# Altium project ADH_XC7Z010_SoC.PrjPcb (part 4 of 10)
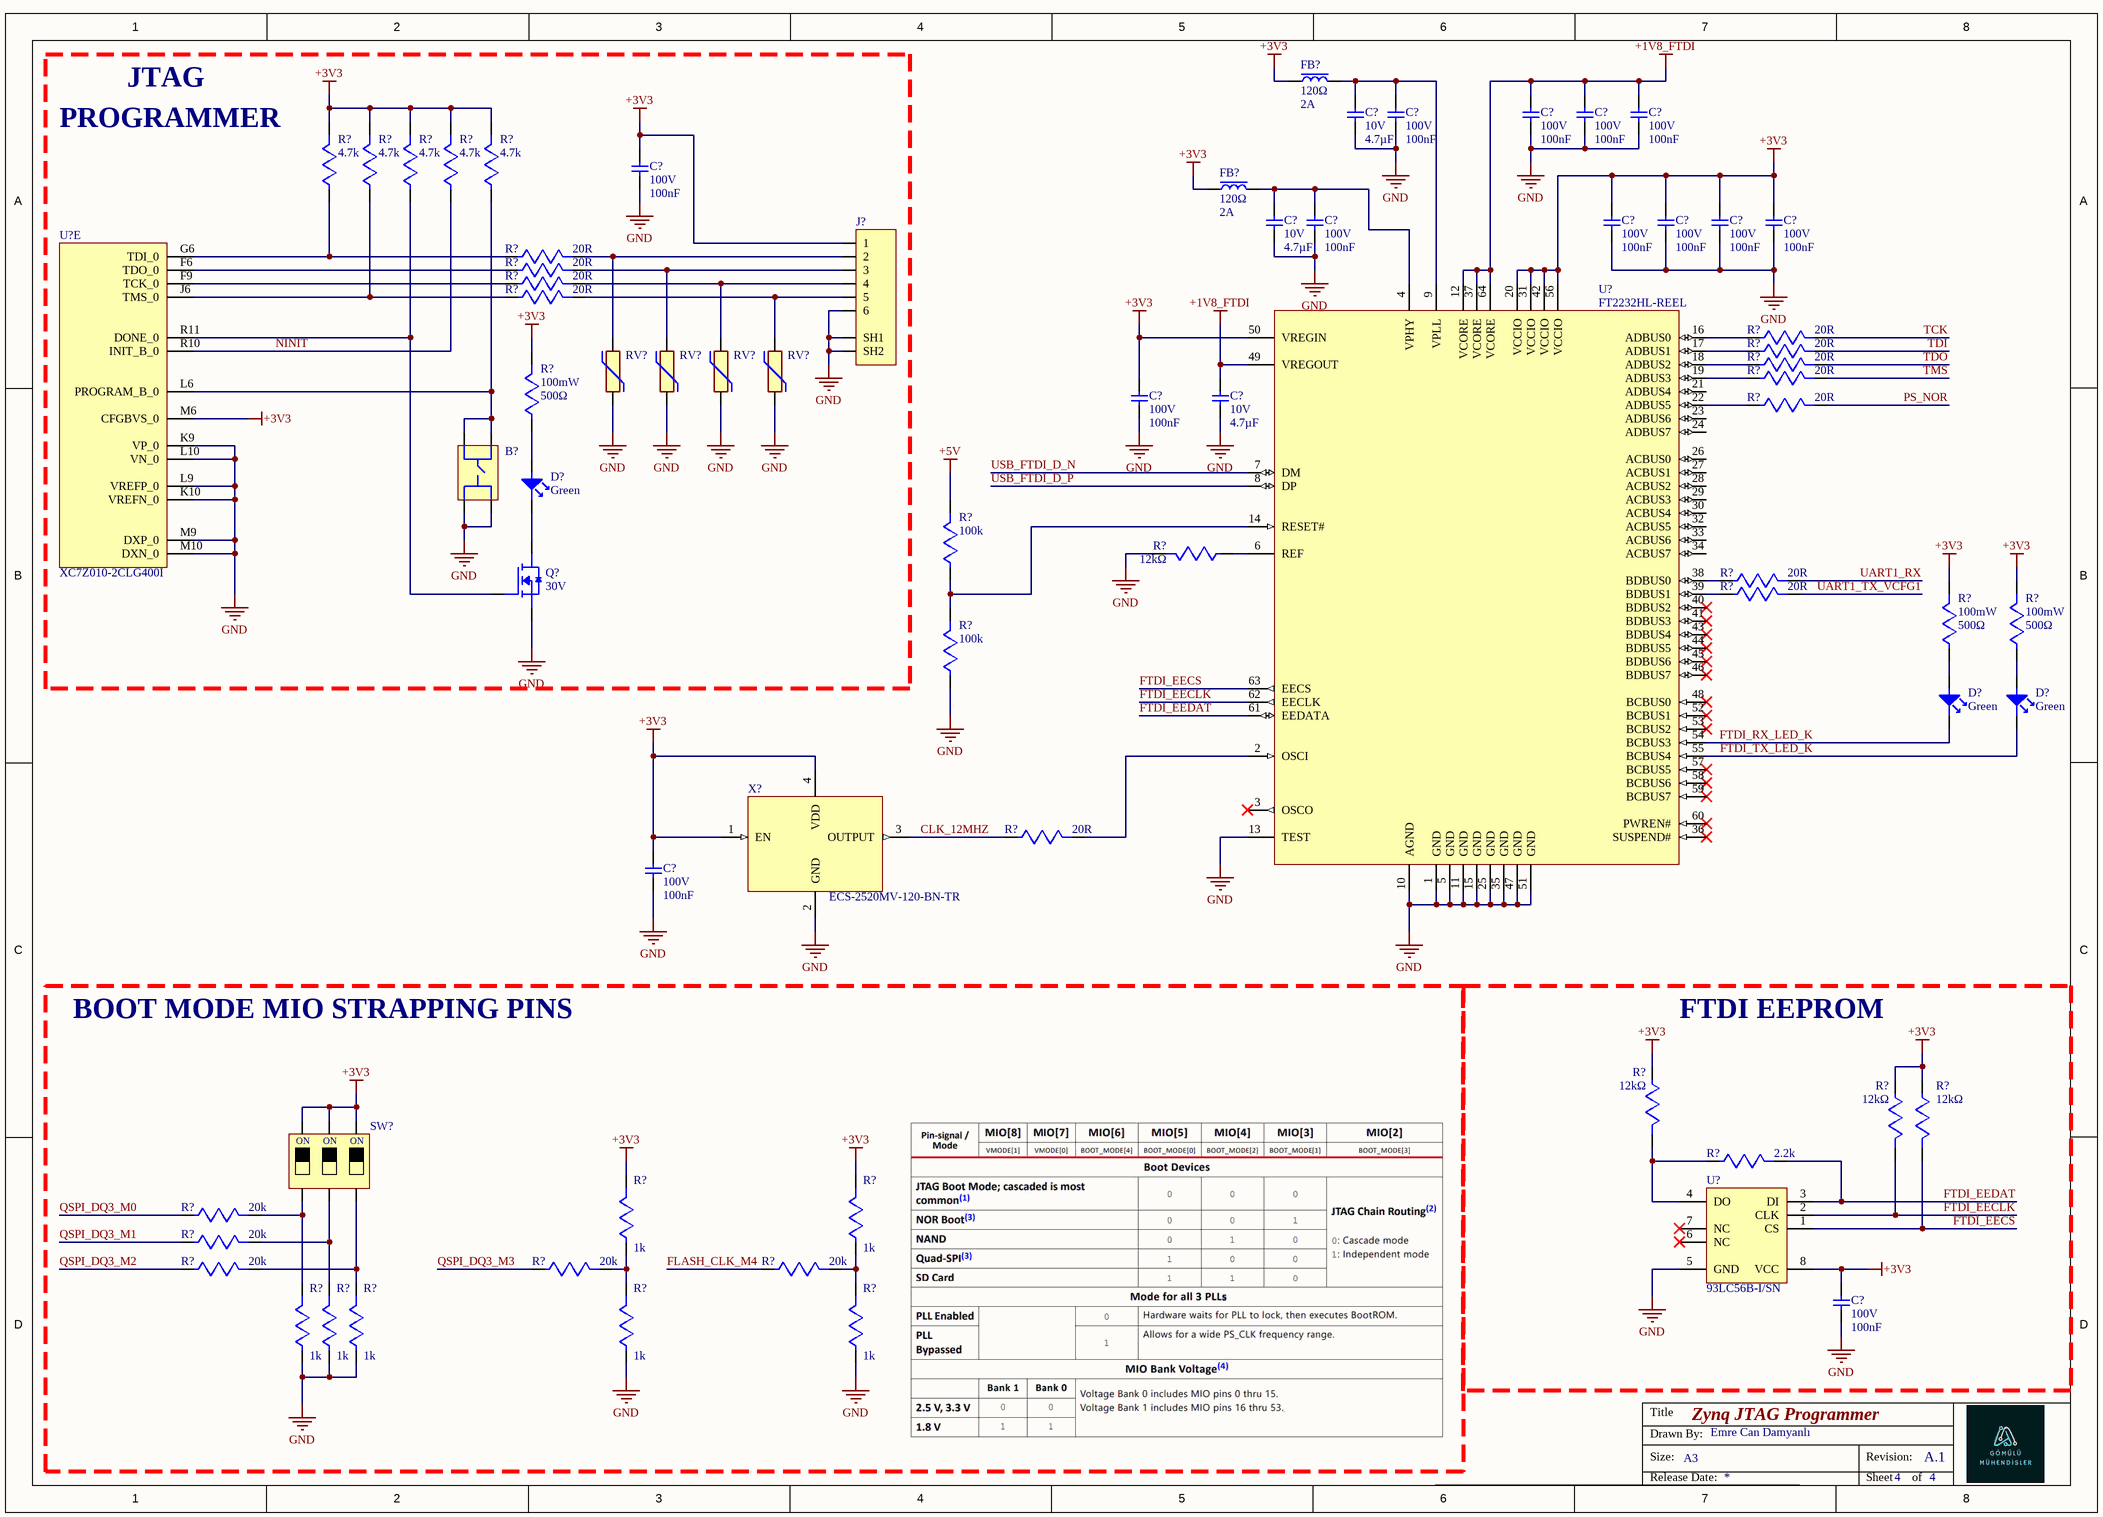
[diagram p9: Zynq_JTAG_Programmer.SchDoc]

## Sheet Zynq_JTAG_Programmer.SchDoc: Zynq JTAG Programmer (continued)

### Library data of the parts
B?#1 = GSPTS0020: Tactile Switch SPST-NO Top Actuated Surface Mount; Datasheet: https://www.ckswitches.com/media/2728/pts815.pdf
C?#100-C?#103 C?#105-C?#110 C?#112 C?#114 C?#115 = GCJ188R72A104KA01D: Cap Ceramic 0.1uF 100V X7R 10% Pad SMD 0603 Soft Termination 125C Automotive T/R; Manufacturer: Murata; Material: 4241ConductorMaterial; Supplier: Digikey; Supplier Part Number: 490-13420-1-ND; Manufacturer Part Number: GCJ188R72A104KA01D; RoHS: Yes; Category: Ceramic Capacitors; Stock: 681954; Pricing: 1=0,19, 10=0,123, 50=0,0774, 100=0,0619, 500=0,04472, 1000=0,03956 (USD); Mounting Technology: Surface Mount; Case/Package: 0603; Case Code (Metric): 1608; Case Code (Imperial): 0603; Min Operating Temperature: -55°C; Max Operating Temperature: 125°C; Packaging: Cut Tape; Tolerance: 10%; Features: Soft Termination; Series: GCJ; Length: 0.063inch; Width: 0.031inch; Height: 900um; Thickness: 0.035inch; Ratings: AEC-Q200; RoHS Compliant: Yes; Lead Free: 5697LeadFree; ComponentLink1URL: https://datasheet.octopart.com/GCJ188R72A104KA01D-Murata-datasheet-78375067.pdf?src-supplier=Future+Electronics; ComponentLink1Description: https://datasheet.octopart.com/GCJ188R72A104KA01D-Murata-datasheet-78375067.pdf?src-supplier=Future+Electronics; ComponentLink2URL: http://search.murata.co.jp/Ceramy/image/img/A01X/partnumbering_e_02.pdf?src-supplier=Digikey; ComponentLink2Description: http://search.murata.co.jp/Ceramy/image/img/A01X/partnumbering_e_02.pdf?src-supplier=Digikey; ComponentLink3URL: https://www.murata.com/~/media/webrenewal/support/library/catalog/products/capacitor/mlcc/c03e.ashx?la=en-us&src-supplier=Digikey; ComponentLink3Description: https://www.murata.com/~/media/webrenewal/support/library/catalog/products/capacitor/mlcc/c03e.ashx?la=en-us&src-supplier=Digikey; ComponentLink4URL: https://datasheet.octopart.com/GCJ188R72A104KA01D-Murata-datasheet-165611796.pdf?src-supplier=TME; ComponentLink4Description: https://datasheet.octopart.com/GCJ188R72A104KA01D-Murata-datasheet-165611796.pdf?src-supplier=TME
C?#104 C?#111 C?#113 = CL05A475MP5NRNC: Ceramic Capacitor, Multilayer, Ceramic, 10V, 20% +Tol, 20% -Tol, X5R, +-15% TC, 4.7uF, Surface Mount, 0402 inch; Manufacturer: Samsung Electro-Mechanics; Supplier: Avnet; Supplier Part Number: CL05A475MP5NRNC; Manufacturer Part Number: CL05A475MP5NRNC; RoHS: Compliant; Category: Ceramic Capacitors; Stock: 40000; Pricing: 10000=0,00671, 20000=0,00663, 40000=0,0066, 80000=0,00656, 160000=0,00653 (USD); Case/Package: 0402; Case Code (Imperial): 0402; Case Code (Metric): 1005; China RoHS: Compliant; Dielectric: X5R; Dielectric Material: Ceramic; Height: 500µm; Lead Free: Lead Free; Length: 1mm; Lifecycle Status: Production; Material: Ceramic; Max Operating Temperature: 85°C; Min Operating Temperature: -55°C; Mounting Technology: Surface Mount; Number of Terminals: 2; REACH SVHC: Yes; Schedule B: 8532240020, 8532240020|8532240020|8532240020|8532240020|8532240020|8532240020|8532240020|8532240020|8532240020|8532240020|8532240020|8532240020|8532240020|8532240020|8532240020|8532240020|8532240020|8532240020|8532240020|8532240020|8532240020|8532240020, 8532240020|8532240020|8532240020|8532240020|8532240020|8532240020|8532240020|8532240020|8532240020|8532240020|8532240020|8532240020|8532240020|8532240020|8532240020|8532240020|8532240020|8532240020|8532240020|8532240020|8532240020|8532240020|8532240020, 8532240020|8532240020|8532240020|8532240020|8532240020|8532240020|8532240020|8532240020|8532240020|8532240020|8532240020|8532240020|8532240020|8532240020|8532240020|8532240020|8532240020|8532240020|8532240020|8532240020|8532240020|8532240020|8532240020|85; Thickness: 558.8µm; Tolerance: 20%; Voltage Rating (DC): 10V; Width: 500µm; ComponentLink1URL: https://datasheet.octopart.com:443/CL05A475MP5NRNC-Samsung-Electro-Mechanics-datasheet-181551186.pdf?src-supplier=Newark; ComponentLink1Description: https://datasheet.octopart.com:443/CL05A475MP5NRNC-Samsung-Electro-Mechanics-datasheet-181551186.pdf?src-supplier=Newark; ComponentLink2URL: https://datasheet.octopart.com:443/CL05A475MP5NRNC-Samsung-Electro-Mechanics-datasheet-136482298.pdf?src-supplier=Newark; ComponentLink2Description: https://datasheet.octopart.com:443/CL05A475MP5NRNC-Samsung-Electro-Mechanics-datasheet-136482298.pdf?src-supplier=Newark; ComponentLink3URL: https://datasheet.octopart.com:443/CL05A475MP5NRNC-Samsung-Electro-Mechanics-datasheet-136031736.pdf?src-supplier=Future+Electronics; ComponentLink3Description: https://datasheet.octopart.com:443/CL05A475MP5NRNC-Samsung-Electro-Mechanics-datasheet-136031736.pdf?src-supplier=Future+Electronics; ComponentLink4URL: https://datasheet.octopart.com:443/CL05A475MP5NRNC-Samsung-Electro-Mechanics-datasheet-110226226.pdf?src-supplier=Future+Electronics; ComponentLink4Description: https://datasheet.octopart.com:443/CL05A475MP5NRNC-Samsung-Electro-Mechanics-datasheet-110226226.pdf?src-supplier=Future+Electronics; ComponentLink5URL: https://datasheet.octopart.com:443/CL05A475MP5NRNC-Samsung-Electro-Mechanics-datasheet-87580058.pdf?src-supplier=Future+Electronics; ComponentLink5Description: https://datasheet.octopart.com:443/CL05A475MP5NRNC-Samsung-Electro-Mechanics-datasheet-87580058.pdf?src-supplier=Future+Electronics; ComponentLink6URL: https://datasheet.octopart.com:443/CL05A475MP5NRNC-Samsung-Electro-Mechanics-datasheet-81461611.pdf?src-supplier=Future+Electronics; ComponentLink6Description: https://datasheet.octopart.com:443/CL05A475MP5NRNC-Samsung-Electro-Mechanics-datasheet-81461611.pdf?src-supplier=Future+Electronics; ComponentLink7URL: https://datasheet.octopart.com:443/CL05A475MP5NRNC-Samsung-datasheet-48647200.pdf?src-supplier=Future+Electronics; ComponentLink7Description: https://datasheet.octopart.com:443/CL05A475MP5NRNC-Samsung-datasheet-48647200.pdf?src-supplier=Future+Electronics; ComponentLink8URL: https://datasheet.octopart.com:443/CL05A475MP5NRNC-Samsung-datasheet-34153549.pdf?src-supplier=Future+Electronics; ComponentLink8Description: https://datasheet.octopart.com:443/CL05A475MP5NRNC-Samsung-datasheet-34153549.pdf?src-supplier=Future+Electronics; ComponentLink9URL: https://datasheet.octopart.com:443/CL05A475MP5NRNC-Samsung-datasheet-26589015.pdf?src-supplier=Future+Electronics; ComponentLink9Description: https://datasheet.octopart.com:443/CL05A475MP5NRNC-Samsung-datasheet-26589015.pdf?src-supplier=Future+Electronics; ComponentLink10URL: https://datasheet.octopart.com:443/CL05A475MP5NRNC-Samsung-datasheet-8324245.pdf?src-supplier=Future+Electronics; ComponentLink10Description: https://datasheet.octopart.com:443/CL05A475MP5NRNC-Samsung-datasheet-8324245.pdf?src-supplier=Future+Electronics; ComponentLink11URL: https://datasheet.octopart.com:443/CL05A475MP5NRNC-Samsung-Electro-Mechanics-datasheet-149136695.pdf?src-supplier=Future+Electronics; ComponentLink11Description: https://datasheet.octopart.com:443/CL05A475MP5NRNC-Samsung-Electro-Mechanics-datasheet-149136695.pdf?src-supplier=Future+Electronics; ComponentLink12URL: https://datasheet.octopart.com:443/CL05A475MP5NRNC-Samsung-datasheet-8326407.pdf?src-supplier=TME; ComponentLink12Description: https://datasheet.octopart.com:443/CL05A475MP5NRNC-Samsung-datasheet-8326407.pdf?src-supplier=TME
D?#4-D?#6 = LTST-C191KGKT: LTST-C191KGKT Lite-On LED, green, 18-71mcd, 130, 1.9V-2.4V SMD, 0603 1.6x0.8x0.55mm RoHS; Manufacturer: Vishay Lite-On; Lens Color: Colorless; Luminous Intensity: 35mcd; Viewing Angle: 130°; Lens Style: Flat,Rectangular,Colorless; Forward Voltage: 2V; Dominant Wavelength: 571nm; Test Current: 20mA; Lens Transparency: Clear; Wavelength: 574nm; Number of LEDs: 1; Max Power Dissipation: 75mW; Lens Size: 0.8mm; Supplier: Digi-Key; Supplier Part Number: 160-1446-1-ND; Manufacturer Part Number: LTST-C191KGKT; RoHS: Yes; Stock: 1655174; Pricing: 1=0,25, 10=0,136, 100=0,063, 500=0,05818, 1000=0,04557, 2000=0,0446 (USD); Mounting Technology: Surface Mount; Case/Package: 0603; Pins: 2; Case Code (Metric): 1608; Case Code (Imperial): 0603; Min Operating Temperature: -55°C; Max Operating Temperature: 85°C; Packaging: Tape and Reel; Series: -; Length: 1.6mm; Width: 0.8mm; Height: 0.65mm; RoHS Compliant: Yes; Lead Free: Lead Free; ComponentLink1URL: https://datasheet.ciiva.com/2109/ltst-c191kgkt-2109973.pdf?src-supplier=Digi-Key; ComponentLink1Description: https://datasheet.ciiva.com/2109/ltst-c191kgkt-2109973.pdf?src-supplier=Digi-Key
FB?#3 FB?#4 = BLM15PX121SN1D: Ferrite Beads Multi-Layer 120Ohm 25% 100MHz 2A 0.055Ohm DCR 0402 T/R; Manufacturer: Murata; Current Rating: 1.1A; DC Resistance (DCR): 55mΩ; Material: Steel; Number of Circuits: 1; Supplier: Arrow Electronics; Supplier Part Number: BLM15PX121SN1D; Manufacturer Part Number: BLM15PX121SN1D; RoHS: Compliant; Category: Ferrite Beads and Chips; Stock: 81241; Pricing: 4237=0,0236, 6000=0,023, 15000=0,023, 30000=0,022, 75000=0,022 (USD); Case/Package: 0402; Case Code (Imperial): 0402; Case Code (Metric): 1005; Contact Plating: Tin; Core Material: Ferrite; Height: 500µm; Lead Free: Lead Free; Length: 1mm; Lifecycle Status: Production; Max DC Current: 2A; Max Operating Temperature: 125°C; Min Operating Temperature: -55°C; Number of Lines: 1; Pins: 2; Number of Terminals: 2; Packaging: Tape and Reel; REACH SVHC: Yes; RMS Current (Irms): 2A; Schedule B: 8504500000, 8504500000|8504500000, 8504500000|8504500000|8504500000, 8504500000|8504500000|8504500000|8504500000; ESR: 55mΩ; Termination: SMD/SMT; Test Frequency: 100MHz; Tolerance: 25%; Weight: 652.039032µg; Width: 500µm; ComponentLink1URL: https://datasheet.octopart.com:443/BLM15PX121SN1D-Murata-datasheet-180806543.pdf?src-supplier=IHS; ComponentLink1Description: https://datasheet.octopart.com:443/BLM15PX121SN1D-Murata-datasheet-180806543.pdf?src-supplier=IHS; ComponentLink2URL: https://datasheet.octopart.com:443/BLM15PX121SN1D-Murata-datasheet-12522583.pdf?src-supplier=Upverter; ComponentLink2Description: https://datasheet.octopart.com:443/BLM15PX121SN1D-Murata-datasheet-12522583.pdf?src-supplier=Upverter; ComponentLink3URL: https://datasheet.octopart.com:443/BLM15PX121SN1D-Murata-datasheet-10083551.pdf?src-supplier=Upverter; ComponentLink3Description: https://datasheet.octopart.com:443/BLM15PX121SN1D-Murata-datasheet-10083551.pdf?src-supplier=Upverter; ComponentLink4URL: https://datasheet.octopart.com:443/BLM15PX121SN1D-Murata-datasheet-8508678.pdf?src-supplier=Upverter; ComponentLink4Description: https://datasheet.octopart.com:443/BLM15PX121SN1D-Murata-datasheet-8508678.pdf?src-supplier=Upverter; ComponentLink5URL: https://datasheet.octopart.com:443/BLM15PX121SN1D-Murata-datasheet-39128427.pdf?src-supplier=Newark; ComponentLink5Description: https://datasheet.octopart.com:443/BLM15PX121SN1D-Murata-datasheet-39128427.pdf?src-supplier=Newark; ComponentLink6URL: https://datasheet.octopart.com:443/BLM15PX121SN1D-Murata-datasheet-166171473.pdf?src-supplier=TME; ComponentLink6Description: https://datasheet.octopart.com:443/BLM15PX121SN1D-Murata-datasheet-166171473.pdf?src-supplier=TME; ComponentLink7URL: https://datasheet.octopart.com:443/BLM15PX121SN1D-Murata-datasheet-141257890.pdf?src-supplier=Ciiva; ComponentLink7Description: https://datasheet.octopart.com:443/BLM15PX121SN1D-Murata-datasheet-141257890.pdf?src-supplier=Ciiva; ComponentLink8URL: https://datasheet.octopart.com:443/BLM15PX121SN1D-Murata-datasheet-138706708.pdf?src-supplier=Ciiva; ComponentLink8Description: https://datasheet.octopart.com:443/BLM15PX121SN1D-Murata-datasheet-138706708.pdf?src-supplier=Ciiva; ComponentLink9URL: https://datasheet.octopart.com:443/BLM15PX121SN1D-Murata-datasheet-78375072.pdf?src-supplier=Future+Electronics; ComponentLink9Description: https://datasheet.octopart.com:443/BLM15PX121SN1D-Murata-datasheet-78375072.pdf?src-supplier=Future+Electronics; ComponentLink10URL: https://datasheet.octopart.com:443/BLM15PX121SN1D-Murata-datasheet-13563506.pdf?src-supplier=Future+Electronics; ComponentLink10Description: https://datasheet.octopart.com:443/BLM15PX121SN1D-Murata-datasheet-13563506.pdf?src-supplier=Future+Electronics; ComponentLink11URL: https://datasheet.octopart.com:443/BLM15PX121SN1D-Murata-datasheet-12545319.pdf?src-supplier=Future+Electronics; ComponentLink11Description: https://datasheet.octopart.com:443/BLM15PX121SN1D-Murata-datasheet-12545319.pdf?src-supplier=Future+Electronics; ComponentLink12URL: https://datasheet.octopart.com/BLM15PX121SN1D-Murata-datasheet-37129980.pdf; ComponentLink12Description: https://datasheet.octopart.com/BLM15PX121SN1D-Murata-datasheet-37129980.pdf; ComponentLink13URL: http://sigma.octopart.com:80/reach_statement/Murata-company-16.pdf?src-supplier=Compliance+Statements; ComponentLink13Description: http://sigma.octopart.com:80/reach_statement/Murata-company-16.pdf?src-supplier=Compliance+Statements
J?#2 = S6B-ZR-SM4A-TF: Header S6B-ZR-SM4A-TF, 1.50mm, 6-contacts, side entry, SMT, /1000/reel; Manufacturer: JST; Number of Contacts: 6; Gender: Male; Supplier: Digi-Key; Supplier Part Number: 455-S6B-ZR-SM4A-TFCT-ND; Manufacturer Part Number: S6B-ZR-SM4A-TF; RoHS: Yes; Category: Connectors; Stock: 59171; Pricing: 1=0,8, 10=0,701, 100=0,578, 500=0,50258 (USD); Mounting Technology: Surface Mount; Contact Plating: Tin; Contact Material: Brass; Number of Rows: 1; Termination: SMD/SMT; Packaging: Cut Tape; Series: ZH; Orientation: Horizontal; Reach SVHC Compliant: Yes; ComponentLink1URL: http://www.farnell.com/datasheets/1393424.pdf?src-supplier=Farnell; ComponentLink1Description: http://www.farnell.com/datasheets/1393424.pdf?src-supplier=Farnell; ComponentLink2URL: http://www.farnell.com/datasheets/621906.pdf?src-supplier=Newark; ComponentLink2Description: http://www.farnell.com/datasheets/621906.pdf?src-supplier=Newark; ComponentLink3URL: http://www.farnell.com/datasheets/621906.pdf?src-supplier=Element14; ComponentLink3Description: http://www.farnell.com/datasheets/621906.pdf?src-supplier=Element14
Q?#5 = DMG3402L-7: MOSFET N-CH 30V 4A SOT23; Manufacturer: Diodes; Rds On Max: 52mR; Input Capacitance: 464pF; Rise Time: 1.6ns; Max Power Dissipation: 1.4W; Fall Time: 2ns; Turn-Off Delay Time: 10.3ns; Turn-On Delay Time: 1.9ns; Gate to Source Voltage (Vgs): 12V; Number of Channels: 1; Polarity: N-CHANNEL; Supplier: Digi-Key; Supplier Part Number: DMG3402L-7DICT-ND; Manufacturer Part Number: DMG3402L-7; RoHS: Yes; Category: MOSFETs; Stock: 1011067; Pricing: 1=0,42, 10=0,298, 100=0,1503, 500=0,13316, 1000=0,10363 (USD); Mounting Technology: Surface Mount; Case/Package: SOT-23; Pins: 3; Weight: 0.000282oz; Min Operating Temperature: -55°C; Max Operating Temperature: 150°C; Package Quantity: 3000; Packaging: Tape and Reel; Continuous Drain Current (ID): 4A; Drain to Source Resistance: 52mR; Series: -; RoHS Compliant: Yes; Lead Free: Lead Free; ComponentLink1URL: http://www.mouser.com/ds/2/115/DMG3402L-473526.pdf?src-supplier=Mouser; ComponentLink1Description: http://www.mouser.com/ds/2/115/DMG3402L-473526.pdf?src-supplier=Mouser; ComponentLink2URL: http://diodes.com/datasheets/DMG3402L.pdf?src-supplier=Avnet; ComponentLink2Description: http://diodes.com/datasheets/DMG3402L.pdf?src-supplier=Avnet
R?#35-R?#39 = RC0603FR-074K7L: SMD Chip Resistor, 4.7 kOhm, ± 1%, 100 mW, 0603 [1608 Metric], Thick Film, General Purpose; Manufacturer: Yageo; Power Rating: 100mW; Voltage Rating (DC): 50V; Temperature Coefficient: 100ppm/°C; Supplier: Digi-Key; Supplier Part Number: 311-4.70KHRCT-ND; Manufacturer Part Number: RC0603FR-074K7L; RoHS: Yes; Category: Chip SMD Resistors; Stock: 7233601; Pricing: 1=0,1, 10=0,018, 50=0,0106, 100=0,0088, 500=0,00592, 1000=0,00505 (USD); Case/Package: 0603; Pins: 2; Case Code (Imperial): 0603; Case Code (Metric): 1608; Min Operating Temperature: -55°C; Max Operating Temperature: 155°C; Tolerance: 1%; Resistor Type: Thick Film; Packaging: Tape and Reel; Voltage Rating: 50V; Termination: SMD/SMT; Features: Moisture Resistant; Series: RC; Max Power Dissipation: 100mW; Number of Terminations: 2; Construction: Rectangular; Resistance Tolerance: 1%; Length: 1.6mm; Width: 0.8mm; Depth: 0.8mm; Lead Pitch: 0.3mm; Lead Free: Lead Free; Reach SVHC Compliant: Unknown; RoHS Compliant: Yes; Military Standard: Not; ComponentLink1URL: https://datasheet.ciiva.com/15189/getdatasheetpartid-422754-15189760.pdf?src-supplier=Verical; ComponentLink1Description: https://datasheet.ciiva.com/15189/getdatasheetpartid-422754-15189760.pdf?src-supplier=Verical; ComponentLink2URL: https://datasheet.ciiva.com/7660/38590-7660794.pdf?src-supplier=Element14; ComponentLink2Description: https://datasheet.ciiva.com/7660/38590-7660794.pdf?src-supplier=Element14; ComponentLink3URL: https://datasheet.ciiva.com/22747/443971-22747528.pdf?src-supplier=Element14; ComponentLink3Description: https://datasheet.ciiva.com/22747/443971-22747528.pdf?src-supplier=Element14; ComponentLink4URL: https://datasheet.ciiva.com/46440/1868787-46440909.pdf?src-supplier=Element14; ComponentLink4Description: https://datasheet.ciiva.com/46440/1868787-46440909.pdf?src-supplier=Element14; ComponentLink5URL: https://datasheet.ciiva.com/7746/1868787-7746365.pdf?src-supplier=Element14; ComponentLink5Description: https://datasheet.ciiva.com/7746/1868787-7746365.pdf?src-supplier=Element14; ComponentLink6URL: https://datasheet.ciiva.com/7746/1738695-7746366.pdf?src-supplier=Element14; ComponentLink6Description: https://datasheet.ciiva.com/7746/1738695-7746366.pdf?src-supplier=Element14
R?#40-R?#47 R?#49 R?#52 R?#53 R?#57 = RC0603FR-0720RL: SMD Chip Resistor, 20 Ohm, ± 1%, 100 mW, 0603 [1608 Metric], Thick Film, General Purpose; Manufacturer: Yageo; Power Rating: 100mW; Voltage Rating: 50V; Temperature Coefficient: 100ppm/°C; Working Voltage: 75V; Supplier: Digi-Key; Supplier Part Number: 311-20.0HRCT-ND; Manufacturer Part Number: RC0603FR-0720RL; RoHS: Yes; Category: Chip SMD Resistors; Stock: 293682; Pricing: 1=0,1, 10=0,018, 50=0,0106, 100=0,0088, 500=0,00592, 1000=0,00505 (USD); Case/Package: 0603; Case Code (Imperial): 0603; Case Code (Metric): 1608; Min Operating Temperature: -55°C; Max Operating Temperature: 155°C; Tolerance: 1%; Packaging: Tape and Reel; Package Quantity: 5000; Termination: SMD/SMT; Resistor Type: Thick Film; Number of Terminations: 2; Max Power Dissipation: 100mW; Voltage Rating (DC): 50V; Features: Moisture Resistant; Series: RC; Construction: Rectangular; Technology: THICK FILM; Resistance Tolerance: 1%; Length: 1.6mm; Width: 0.031inch; Height: 0.45mm; Depth: 0.8mm; Reach SVHC Compliant: No; Military Standard: Not; Lead Free: Lead Free; RoHS Compliant: Yes; ComponentLink1URL: https://datasheet.ciiva.com/11819/0900766b80f96399-11819290.pdf?src-supplier=Rs; ComponentLink1Description: https://datasheet.ciiva.com/11819/0900766b80f96399-11819290.pdf?src-supplier=Rs; ComponentLink2URL: https://datasheet.ciiva.com/46395/443971-46395031.pdf?src-supplier=Element14; ComponentLink2Description: https://datasheet.ciiva.com/46395/443971-46395031.pdf?src-supplier=Element14; ComponentLink3URL: https://datasheet.ciiva.com/2454/pyu-r-int-thick-7-2454028.pdf?src-supplier=Digi-Key; ComponentLink3Description: https://datasheet.ciiva.com/2454/pyu-r-int-thick-7-2454028.pdf?src-supplier=Digi-Key; ComponentLink4URL: https://datasheet.ciiva.com/2454/pyu-r-int-thick-7-2454029.pdf?src-supplier=Digi-Key; ComponentLink4Description: https://datasheet.ciiva.com/2454/pyu-r-int-thick-7-2454029.pdf?src-supplier=Digi-Key; ComponentLink5URL: https://datasheet.ciiva.com/2454/pyu-r-int-thick-7-2454027.pdf?src-supplier=Digi-Key; ComponentLink5Description: https://datasheet.ciiva.com/2454/pyu-r-int-thick-7-2454027.pdf?src-supplier=Digi-Key; ComponentLink6URL: https://datasheet.ciiva.com/12557/rc0603-272842-12557941.pdf?src-supplier=Mouser; ComponentLink6Description: https://datasheet.ciiva.com/12557/rc0603-272842-12557941.pdf?src-supplier=Mouser; ComponentLink7URL: https://datasheet.ciiva.com/15189/getdatasheetpartid-324013-15189653.pdf?src-supplier=Verical; ComponentLink7Description: https://datasheet.ciiva.com/15189/getdatasheetpartid-324013-15189653.pdf?src-supplier=Verical
R?#48 R?#54 R?#55 = RT0603BRC07500RL: Fixed Resistor, Thin Film, 0.1W, 500ohm, 75V, 0.1% +/-Tol, 15ppm/Cel, Surface Mount, 0603; Manufacturer: Yageo Group; Temperature Coefficient: 15ppm/°C; Supplier: Farnell; Supplier Part Number: 4152629; Manufacturer Part Number: RT0603BRC07500RL; RoHS: Compliant; Category: Chip SMD Resistors; Stock: 4870; Pricing: 5000=0,12 (EUR); Case/Package: 0603; China RoHS: Non-Compliant; Composition: Thin Film; Height: 450µm; Lifecycle Status: Production; Max Operating Temperature: 155°C; Min Operating Temperature: -55°C; Mounting Technology: Surface Mount; Number of Terminals: 2; Packaging: Tape & Reel; Power Dissipation: 100mW; REACH SVHC: Yes; Tolerance: 0.1%; Voltage Rating: 75V; Width: 800µm; Working Voltage: 75V; ComponentLink1URL: https://datasheet.octopart.com:443/RT0603BRC07500RL-Yageo-datasheet-176402239.pdf?src-supplier=IHS; ComponentLink1Description: https://datasheet.octopart.com:443/RT0603BRC07500RL-Yageo-datasheet-176402239.pdf?src-supplier=IHS; ComponentLink2URL: https://datasheet.octopart.com:443/RT0603BRC07500RL-Yageo-datasheet-141265893.pdf?src-supplier=ODG+(Origin+Data+Global); ComponentLink2Description: https://datasheet.octopart.com:443/RT0603BRC07500RL-Yageo-datasheet-141265893.pdf?src-supplier=ODG+(Origin+Data+Global); ComponentLink3URL: https://datasheet.octopart.com:443/RT0603BRC07500RL-Yageo-datasheet-169971040.pdf?src-supplier=Upverter; ComponentLink3Description: https://datasheet.octopart.com:443/RT0603BRC07500RL-Yageo-datasheet-169971040.pdf?src-supplier=Upverter; ComponentLink4URL: https://datasheet.octopart.com:443/RT0603BRC07500RL-Yageo-datasheet-166250672.pdf?src-supplier=Future+Electronics; ComponentLink4Description: https://datasheet.octopart.com:443/RT0603BRC07500RL-Yageo-datasheet-166250672.pdf?src-supplier=Future+Electronics; ComponentLink5URL: https://datasheet.octopart.com/RT0603BRC07500RL-Yageo-datasheet-86813807.pdf; ComponentLink5Description: https://datasheet.octopart.com/RT0603BRC07500RL-Yageo-datasheet-86813807.pdf; ComponentLink6URL: http://sigma.octopart.com:80/rohs_statement/Yageo-company-2.pdf?src-supplier=Compliance+Statements; ComponentLink6Description: http://sigma.octopart.com:80/rohs_statement/Yageo-company-2.pdf?src-supplier=Compliance+Statements; ComponentLink7URL: http://sigma.octopart.com:80/conflict_mineral_statement/Yageo-company-3.pdf?src-supplier=Compliance+Statements; ComponentLink7Description: http://sigma.octopart.com:80/conflict_mineral_statement/Yageo-company-3.pdf?src-supplier=Compliance+Statements
R?#50 R?#56 = RC0603FR-07100KL: SMD Chip Resistor, 100 kOhm, ± 1%, 100 mW, 0603 [1608 Metric], Thick Film, General Purpose; Manufacturer: Yageo; Temperature Coefficient: 100ppm/°C; Voltage Rating (DC): 50V; Power Rating: 100mW; Supplier: Digi-Key; Supplier Part Number: 311-100KHRCT-ND; Manufacturer Part Number: RC0603FR-07100KL; RoHS: Yes; Category: Chip SMD Resistors; Stock: 3229176; Pricing: 1=0,1, 10=0,018, 50=0,0106, 100=0,0088, 500=0,00592, 1000=0,00505 (USD); Case/Package: 0603; Pins: 2; Case Code (Imperial): 0603; Case Code (Metric): 1608; Min Operating Temperature: -55°C; Max Operating Temperature: 155°C; Tolerance: 1%; Resistor Type: Thick Film; Packaging: Tape and Reel; Voltage Rating: 50V; Termination: SMD/SMT; Number of Terminations: 2; Features: Moisture Resistant; Series: RC; Max Power Dissipation: 100mW; Resistance Tolerance: 1%; Construction: Rectangular; Technology: THICK FILM; Length: 1.6mm; Width: 0.8mm; Height: 0.45mm; Depth: 0.8mm; Reach SVHC Compliant: No; Military Standard: Not; RoHS Compliant: Yes
R?#51 R?#58-R?#60 = RC0603FR-0712KL: 100mW Thick Film Resistors 75V ±100ppm/℃ ±1% 12kΩ 0603 Chip Resistor - Surface Mount ROHS; Manufacturer: Yageo Group; Temperature Coefficient: 100ppm/°C; Voltage Rating: 50V; Supplier: Farnell; Supplier Part Number: 9238611; Manufacturer Part Number: RC0603FR-0712KL; RoHS: Compliant; Category: Chip SMD Resistors; Stock: 298850; Pricing: 10=0,0061, 100=0,0052, 500=0,0048, 1000=0,0043, 2500=0,0036 (EUR); Case/Package: 0603; Case Code (Imperial): 0603; Case Code (Metric): 1608; China RoHS: Non-Compliant; Composition: Thick Film; Depth: 800µm; Features: Moisture Resistant; Height: 450µm; Lead Free: Lead Free; Length: 1.6mm; Lifecycle Status: Production; Max Operating Temperature: 155°C; Max Power Dissipation: 100mW; Military Standard: Not; Min Operating Temperature: -55°C; Mounting Technology: Surface Mount; Pins: 2; Number of Terminals: 2; Number of Terminations: 2; Packaging: Tape and Reel; Power Dissipation: 100mW; Power Rating: 100mW; REACH SVHC: Yes; Schedule B: 8533210045, 8533210045|8533210045|8533210045|8533210045|8533210045; Termination: SMD/SMT; Tolerance: 1%; Voltage Rating (DC): 50V; Width: 800µm; Working Voltage: 75V; ComponentLink1URL: https://datasheet.octopart.com:443/RC0603FR-0712KL-Yageo-datasheet-175887523.pdf?src-supplier=IHS; ComponentLink1Description: https://datasheet.octopart.com:443/RC0603FR-0712KL-Yageo-datasheet-175887523.pdf?src-supplier=IHS; ComponentLink2URL: https://datasheet.octopart.com:443/RC0603FR-0712KL-Yageo-datasheet-8328172.pdf?src-supplier=Newark; ComponentLink2Description: https://datasheet.octopart.com:443/RC0603FR-0712KL-Yageo-datasheet-8328172.pdf?src-supplier=Newark; ComponentLink3URL: https://datasheet.octopart.com:443/RC0603FR-0712KL-Yageo-datasheet-175423674.pdf?src-supplier=Newark; ComponentLink3Description: https://datasheet.octopart.com:443/RC0603FR-0712KL-Yageo-datasheet-175423674.pdf?src-supplier=Newark; ComponentLink4URL: https://datasheet.octopart.com:443/RC0603FR-0712KL-Yageo-datasheet-34211833.pdf?src-supplier=Newark; ComponentLink4Description: https://datasheet.octopart.com:443/RC0603FR-0712KL-Yageo-datasheet-34211833.pdf?src-supplier=Newark; ComponentLink5URL: https://datasheet.octopart.com:443/RC0603FR-0712KL-Yageo-datasheet-62067350.pdf?src-supplier=element14+APAC; ComponentLink5Description: https://datasheet.octopart.com:443/RC0603FR-0712KL-Yageo-datasheet-62067350.pdf?src-supplier=element14+APAC; ComponentLink6URL: https://datasheet.octopart.com:443/RC0603FR-0712KL-Yageo-datasheet-103092701.pdf?src-supplier=Upverter; ComponentLink6Description: https://datasheet.octopart.com:443/RC0603FR-0712KL-Yageo-datasheet-103092701.pdf?src-supplier=Upverter; ComponentLink7URL: https://datasheet.octopart.com:443/RC0603FR-0712KL-Yageo-datasheet-141435368.pdf?src-supplier=Upverter; ComponentLink7Description: https://datasheet.octopart.com:443/RC0603FR-0712KL-Yageo-datasheet-141435368.pdf?src-supplier=Upverter; ComponentLink8URL: https://datasheet.octopart.com:443/RC0603FR-0712KL-Yageo-Group-datasheet-190305687.pdf?src-supplier=Future+Electronics; ComponentLink8Description: https://datasheet.octopart.com:443/RC0603FR-0712KL-Yageo-Group-datasheet-190305687.pdf?src-supplier=Future+Electronics; ComponentLink9URL: https://datasheet.octopart.com:443/RC0603FR-0712KL-Yageo-datasheet-164759695.pdf?src-supplier=Future+Electronics; ComponentLink9Description: https://datasheet.octopart.com:443/RC0603FR-0712KL-Yageo-datasheet-164759695.pdf?src-supplier=Future+Electronics; ComponentLink10URL: https://datasheet.octopart.com:443/RC0603FR-0712KL-Yageo-datasheet-137700087.pdf?src-supplier=Future+Electronics; ComponentLink10Description: https://datasheet.octopart.com:443/RC0603FR-0712KL-Yageo-datasheet-137700087.pdf?src-supplier=Future+Electronics; ComponentLink11URL: https://datasheet.octopart.com:443/RC0603FR0712KL-Yageo-datasheet-27584510.pdf?src-supplier=Future+Electronics; ComponentLink11Description: https://datasheet.octopart.com:443/RC0603FR0712KL-Yageo-datasheet-27584510.pdf?src-supplier=Future+Electronics; ComponentLink12URL: https://datasheet.octopart.com:443/RC0603FR-0712KL-Yageo-datasheet-15599030.pdf?src-supplier=Future+Electronics; ComponentLink12Description: https://datasheet.octopart.com:443/RC0603FR-0712KL-Yageo-datasheet-15599030.pdf?src-supplier=Future+Electronics; ComponentLink13URL: https://datasheet.octopart.com:443/RC0603FR-0712KL-Yageo-datasheet-12596169.pdf?src-supplier=Future+Electronics; ComponentLink13Description: https://datasheet.octopart.com:443/RC0603FR-0712KL-Yageo-datasheet-12596169.pdf?src-supplier=Future+Electronics; ComponentLink14URL: https://datasheet.octopart.com:443/RC0603FR-0712KL-Yageo-datasheet-8324193.pdf?src-supplier=Future+Electronics; ComponentLink14Description: https://datasheet.octopart.com:443/RC0603FR-0712KL-Yageo-datasheet-8324193.pdf?src-supplier=Future+Electronics; ComponentLink15URL: https://datasheet.octopart.com:443/RC0603FR-0712KL-Yageo-Group-datasheet-176638170.pdf?src-supplier=Farnell; ComponentLink15Description: https://datasheet.octopart.com:443/RC0603FR-0712KL-Yageo-Group-datasheet-176638170.pdf?src-supplier=Farnell; ComponentLink16URL: https://datasheet.octopart.com/RC0603FR-0712KL-Yageo-datasheet-73766026.pdf; ComponentLink16Description: https://datasheet.octopart.com/RC0603FR-0712KL-Yageo-datasheet-73766026.pdf; ComponentLink17URL: https://datasheet.octopart.com:443/RC0603FR-0712KL-Yageo-datasheet-30459151.pdf?src-supplier=Seeed+Studio; ComponentLink17Description: https://datasheet.octopart.com:443/RC0603FR-0712KL-Yageo-datasheet-30459151.pdf?src-supplier=Seeed+Studio; ComponentLink18URL: https://datasheet.octopart.com:443/RC0603FR-0712KL-Yageo-datasheet-118562.pdf?src-supplier=DigiKey; ComponentLink18Description: https://datasheet.octopart.com:443/RC0603FR-0712KL-Yageo-datasheet-118562.pdf?src-supplier=DigiKey; ComponentLink19URL: http://sigma.octopart.com:80/conflict_mineral_statement/Yageo-company-3.pdf?src-supplier=Compliance+Statements; ComponentLink19Description: http://sigma.octopart.com:80/conflict_mineral_statement/Yageo-company-3.pdf?src-supplier=Compliance+Statements; ComponentLink20URL: http://sigma.octopart.com:80/rohs_statement/Yageo-company-2.pdf?src-supplier=Compliance+Statements; ComponentLink20Description: http://sigma.octopart.com:80/rohs_statement/Yageo-company-2.pdf?src-supplier=Compliance+Statements
R?#61 = RC0603FR-072K2L: SMD Chip Resistor, 2.2 kOhm, ± 1%, 100 mW, 0603 [1608 Metric], Thick Film, General Purpose; Manufacturer: Yageo; Temperature Coefficient: 100ppm/°C; Power Rating: 100mW; Voltage Rating: 50V; Supplier: Digi-Key; Supplier Part Number: 311-2.20KHRCT-ND; Manufacturer Part Number: RC0603FR-072K2L; RoHS: Yes; Category: Chip SMD Resistors; Stock: 709886; Pricing: 1=0,1, 10=0,019, 50=0,0112, 100=0,0093, 500=0,00622, 1000=0,00532 (USD); Case/Package: 0603; Case Code (Imperial): 0603; Case Code (Metric): 1608; Min Operating Temperature: -55°C; Max Operating Temperature: 155°C; Tolerance: 1%; Packaging: Tape and Reel; Resistor Type: Thick Film; Number of Terminations: 2; Max Power Dissipation: 100mW; Features: Moisture Resistant; Series: RC; Resistance Tolerance: 1%; Lead Free: Lead Free; Reach SVHC Compliant: Unknown; RoHS Compliant: Yes
R?#62 R?#65-R?#68 = RC0603FR-0720KL: SMD Chip Resistor, 20 kOhm, ± 1%, 100 mW, 0603 [1608 Metric], Thick Film, General Purpose; Manufacturer: Yageo; Temperature Coefficient: 100ppm/°C; Voltage Rating (DC): 50V; Power Rating: 100mW; Supplier: Digi-Key; Supplier Part Number: 311-20.0KHRCT-ND; Manufacturer Part Number: RC0603FR-0720KL; RoHS: Yes; Category: Chip SMD Resistors; Stock: 6106196; Pricing: 1=0,1, 10=0,018, 50=0,0106, 100=0,0088, 500=0,00592, 1000=0,00505 (USD); Case/Package: 0603; Pins: 2NUMBER; Case Code (Imperial): 0603; Case Code (Metric): 1608; Min Operating Temperature: -55°C; Max Operating Temperature: 155°C; Tolerance: 1%; Packaging: Tape and Reel; Resistor Type: Thick Film; Voltage Rating: 50V; Package Quantity: 1; Termination: SMD/SMT; Number of Terminations: 2; Max Power Dissipation: 100mW; Features: Moisture Resistant; Series: RC; Technology: THICK FILM; Construction: Rectangular; Resistance Tolerance: 1%; Length: 0.063inch; Width: 0.031inch; Height: 0.022inch; Depth: 0.8mm; RoHS Compliant: Yes; Lead Free: 5697LeadFree; Reach SVHC Compliant: No; Military Standard: Not; ComponentLink1URL: https://datasheet.ciiva.com/11808/0900766b80f96399-11808275.pdf?src-supplier=Rs; ComponentLink1Description: https://datasheet.ciiva.com/11808/0900766b80f96399-11808275.pdf?src-supplier=Rs; ComponentLink2URL: https://datasheet.ciiva.com/22747/443971-22747525.pdf?src-supplier=Element14; ComponentLink2Description: https://datasheet.ciiva.com/22747/443971-22747525.pdf?src-supplier=Element14; ComponentLink3URL: https://datasheet.ciiva.com/2453/pyu-r-int-thick-7-2453911.pdf?src-supplier=Digi-Key; ComponentLink3Description: https://datasheet.ciiva.com/2453/pyu-r-int-thick-7-2453911.pdf?src-supplier=Digi-Key; ComponentLink4URL: https://datasheet.ciiva.com/2453/pyu-r-int-thick-7-2453912.pdf?src-supplier=Digi-Key; ComponentLink4Description: https://datasheet.ciiva.com/2453/pyu-r-int-thick-7-2453912.pdf?src-supplier=Digi-Key; ComponentLink5URL: https://datasheet.ciiva.com/2453/pyu-r-int-thick-7-2453910.pdf?src-supplier=Digi-Key; ComponentLink5Description: https://datasheet.ciiva.com/2453/pyu-r-int-thick-7-2453910.pdf?src-supplier=Digi-Key
R?#63 R?#64 R?#69-R?#73 = RC0603FR-071KL: SMD Chip Resistor, 1 kOhm, ± 1%, 100 mW, 0603 [1608 Metric], Thick Film, General Purpose; Manufacturer: Yageo; Temperature Coefficient: 100ppm/°C; Power Rating: 100mW; Voltage Rating: 50V; Supplier: Digi-Key; Supplier Part Number: 311-1.00KHRCT-ND; Manufacturer Part Number: RC0603FR-071KL; RoHS: Yes; Category: Chip SMD Resistors; Stock: 18662657; Pricing: 1=0,1, 10=0,018, 50=0,0106, 100=0,0088, 500=0,00592, 1000=0,00505 (USD); Case/Package: 0603; Contact Plating: Tin,Matte; Case Code (Imperial): 0603; Case Code (Metric): 1608; Min Operating Temperature: -55°C; Max Operating Temperature: 155°C; Tolerance: 1%; Resistor Type: Thick Film; Packaging: Tape and Reel; Termination: SMD/SMT; Features: Moisture Resistant; Series: RC; Max Power Dissipation: 100mW; Number of Terminations: 2; Technology: THICK FILM; Resistance Tolerance: 1%; Construction: Rectangular; Length: 1.6mm; Height: 0.45mm; Depth: 0.8mm; Reach SVHC Compliant: No; Military Standard: Not; RoHS Compliant: Yes
RV?#1-RV?#4 = CG0402MLU-3.3G: Varistor 1 Circuit Surface Mount, MLCV 0402 (1005 Metric); Manufacturer_Name: Bourns; Datasheet Link: https://www.bourns.com/docs/Product-Datasheets/MLU.pdf; Height: 0.41mm; Manufacturer_Part_Number: CG0402MLU-3.3G; Mouser Part Number: 652-CG0402MLU-3.3G; Mouser Price/Stock: https://www.mouser.co.uk/ProductDetail/Bourns/CG0402MLU-3.3G?qs=m8myXnDJXpWVM8EQWErxtQ%3D%3D; Arrow Part Number: CG0402MLU-3.3G; Arrow Price/Stock: https://www.arrow.com/en/products/cg0402mlu-3.3g/bourns?utm_currency=USD&region=nac
SW? = 219-3LPST: Switch; Manufacturer_Name: CTS; Datasheet Link: https://www.digikey.ph/en/products/detail/cts-electrocomponents/219-3LPST/223166?msockid=39f1ec84d77b6f4428b7f904d6676eed; Height: 3.85mm; Manufacturer_Part_Number: 219-3LPST; Mouser Part Number: 774-2193LPST; Mouser Price/Stock: https://www.mouser.co.uk/ProductDetail/CTS-Electronic-Components/219-3LPST?qs=qNzHFtQhdJ%252BCQoB5yfrP7Q%3D%3D; Arrow Part Number: 219-3LPST; Arrow Price/Stock: https://www.arrow.com/en/products/219-3lpst/cts
U?#11 = XC7Z010-2CLG400I: MPU Zynq-7000 Thumb-2 32-Bit 733MHz 1.2V/3.3V 400-Pin CS-BGA; Manufacturer: AMD; Core Architecture: ARM; Data Bus Width: 32b; Frequency: 766MHz; Interface: CAN, EBI/EMI, Ethernet, I2C, MMC, SD, SDIO, SPI, UART, USART, USB; Max Supply Voltage: 1.05V; Min Supply Voltage: 950mV; Number of I/Os: 130; Operating Supply Voltage: 1V; Peripherals: DMA; Speed Grade: -2; Supplier: Farnell; Supplier Part Number: 2831085; Manufacturer Part Number: XC7Z010-2CLG400I; RoHS: Compliant; Category: System on Chip (SoC); Stock: 89; Pricing: 1=78,2 (EUR); Case/Package: BGA; China RoHS: Compliant; Contact Plating: Copper, Silver, Tin; Height - Seated (Max): 1.6mm; Length: 17mm; Lifecycle Status: Production; Clock Frequency: 733MHz; Max Operating Temperature: 100°C; Min Operating Temperature: -40°C; Pins: 400; Number of Terminals: 400; Radiation Hardening: No; REACH SVHC: Yes; Terminal Pitch: 800µm; Width: 17mm; ComponentLink1URL: https://datasheet.octopart.com:443/XC7Z010-2CLG400I-AMD-datasheet-159618399.pdf?src-supplier=IHS; ComponentLink1Description: https://datasheet.octopart.com:443/XC7Z010-2CLG400I-AMD-datasheet-159618399.pdf?src-supplier=IHS; ComponentLink2URL: https://datasheet.octopart.com:443/XC7Z010-2CLG400I-Xilinx-datasheet-134531205.pdf?src-supplier=Upverter; ComponentLink2Description: https://datasheet.octopart.com:443/XC7Z010-2CLG400I-Xilinx-datasheet-134531205.pdf?src-supplier=Upverter; ComponentLink3URL: https://datasheet.octopart.com:443/XC7Z010-2CLG400I-AMD-datasheet-101617038.pdf?src-supplier=Farnell; ComponentLink3Description: https://datasheet.octopart.com:443/XC7Z010-2CLG400I-AMD-datasheet-101617038.pdf?src-supplier=Farnell; ComponentLink4URL: https://datasheet.octopart.com:443/XC7Z010-2CLG400I-Xilinx-datasheet-159009919.pdf?src-supplier=Augswan; ComponentLink4Description: https://datasheet.octopart.com:443/XC7Z010-2CLG400I-Xilinx-datasheet-159009919.pdf?src-supplier=Augswan
U?#12 = FT2232HL-REEL: USB Hi-Speed to Dual Channel Serial UART/FIFO/JTAG/SPI/I2C IC - LQFP-64; Manufacturer: FTDI; Data Rate: 60Mbps; Dual Supply Voltage: 3.3V; ESD Protection: Yes; Clock Frequency: 12MHz; Max Supply Voltage: 1.98V; Min Supply Voltage: 1.62V; Number of Channels: 2; Number of Transceivers: 4; Operating Supply Current: 70mA; Operating Supply Voltage: 1.8V; Supplier: Farnell; Supplier Part Number: 1697461; Manufacturer Part Number: FT2232HL-REEL; RoHS: Compliant; Category: UART Interface ICs; Stock: 54563; Pricing: 1=4,6, 10=4,42, 25=4,36, 50=4,31, 100=4,25, 250=4,06, 500=3,84 (EUR); Case/Package: LQFP; Features: I²C; Height: 1.4mm; Height - Seated (Max): 1.6mm; Lead Free: Lead Free; Length: 10mm; Lifecycle Status: Production; Max Operating Temperature: 85°C; Min Operating Temperature: -40°C; Mounting Technology: Surface Mount; Pins: 64; Number of Terminals: 64; Radiation Hardening: No; REACH SVHC: Yes; Schedule B: 8542390000, 8542390000|8542390000|8542390000|8542390000|8542390000; Terminal Pitch: 500µm; Weight: 342.689036mg; Width: 10mm; ComponentLink1URL: https://datasheet.octopart.com:443/FT2232HL-REEL-FTDI-datasheet-182343128.pdf?src-supplier=IHS; ComponentLink1Description: https://datasheet.octopart.com:443/FT2232HL-REEL-FTDI-datasheet-182343128.pdf?src-supplier=IHS; ComponentLink2URL: https://datasheet.octopart.com:443/FT2232HL-REEL-FTDI-datasheet-10548643.pdf?src-supplier=Upverter; ComponentLink2Description: https://datasheet.octopart.com:443/FT2232HL-REEL-FTDI-datasheet-10548643.pdf?src-supplier=Upverter; ComponentLink3URL: https://datasheet.octopart.com:443/FT2232HL-REEL-FTDI-datasheet-12520010.pdf?src-supplier=SHENGYU+ELECTRONICS; ComponentLink3Description: https://datasheet.octopart.com:443/FT2232HL-REEL-FTDI-datasheet-12520010.pdf?src-supplier=SHENGYU+ELECTRONICS; ComponentLink4URL: https://datasheet.octopart.com:443/FT2232HL-REEL-FTDI-datasheet-68321328.pdf?src-supplier=TME; ComponentLink4Description: https://datasheet.octopart.com:443/FT2232HL-REEL-FTDI-datasheet-68321328.pdf?src-supplier=TME; ComponentLink5URL: https://datasheet.octopart.com:443/FT2232HL-REEL-FTDI-datasheet-49858841.pdf?src-supplier=TME; ComponentLink5Description: https://datasheet.octopart.com:443/FT2232HL-REEL-FTDI-datasheet-49858841.pdf?src-supplier=TME; ComponentLink6URL: https://datasheet.octopart.com:443/FT2232HL-REEL-FTDI-datasheet-15949901.pdf?src-supplier=iiiC; ComponentLink6Description: https://datasheet.octopart.com:443/FT2232HL-REEL-FTDI-datasheet-15949901.pdf?src-supplier=iiiC
U?#13 = 93LC56B-I/SN: Microwire Serial EEPROM Family, 2.5Vto 5.5V' 2 MHz, -40°Cto 125°C, SOIC-8, RoHS; Manufacturer: Microchip; Manufacturer Lifecycle Status: REL; Density: 2kb; Frequency: 2MHz; Max Supply Voltage: 5.5V; Memory Size: 250B; Min Supply Voltage: 2.5V; Nominal Supply Current: 2mA; Supplier: Farnell; Supplier Part Number: 9758259; Manufacturer Part Number: 93LC56B-I/SN; RoHS: Compliant; Category: EEPROM; Stock: 4717; Pricing: 1=0,292, 25=0,284, 100=0,277, 250=0,269 (EUR); Projected EOL Date: 2034-05-16; Ambient Temperature Range High: 125°C; Case/Package: SOIC; Contact Plating: Tin; Country of Assembly: Thailand; Country of Fabrication: United States of America; Country of Origin: Thailand; Export Control Classification Number (ECCN) Code: EAR99; Height: 1.75mm; Harmonized Tariff Schedule (HTS) Code: 8542.32.0051; Interface: Serial; Introduction Date: 2002-05-16; Lead Free: Lead Free; Length: 4.9mm; Lifecycle Status: Production; Clock Frequency: 2MHz; Max Operating Temperature: 85°C; Memory Format: EEPROM; Min Operating Temperature: -40°C; Mounting Technology: Surface Mount; Pins: 8; Operating Supply Voltage: 2.5V; Packaging: Bulk; Radiation Hardening: No; REACH SVHC: No; Schedule B: 8542320050, 8542320050|8542320050, 8542320050|8542320050|8542320050, 8542320050|8542320050|8542320050|8542320050; Width: 3.9mm; ComponentLink1URL: https://sigma.octopart.com:443/138896773/technical_drawing/Microchip-93LC56B-I-SN.pdf?src-supplier=Upverter; ComponentLink1Description: https://sigma.octopart.com:443/138896773/technical_drawing/Microchip-93LC56B-I-SN.pdf?src-supplier=Upverter; ComponentLink2URL: https://datasheet.octopart.com:443/93LC56B-I-SN-Microchip-datasheet-8329049.pdf?src-supplier=Upverter; ComponentLink2Description: https://datasheet.octopart.com:443/93LC56B-I-SN-Microchip-datasheet-8329049.pdf?src-supplier=Upverter; ComponentLink3URL: https://datasheet.octopart.com:443/93LC56B-I/SN-Microchip-datasheet-11051705.pdf?src-supplier=Augswan; ComponentLink3Description: https://datasheet.octopart.com:443/93LC56B-I/SN-Microchip-datasheet-11051705.pdf?src-supplier=Augswan; ComponentLink4URL: https://datasheet.octopart.com:443/93LC56B-I-SN-Microchip-datasheet-175858343.pdf?src-supplier=Microchip; ComponentLink4Description: https://datasheet.octopart.com:443/93LC56B-I-SN-Microchip-datasheet-175858343.pdf?src-supplier=Microchip; ComponentLink5URL: https://datasheet.octopart.com:443/93LC56B-I/SN-Microchip-datasheet-1282.pdf?src-supplier=TME; ComponentLink5Description: https://datasheet.octopart.com:443/93LC56B-I/SN-Microchip-datasheet-1282.pdf?src-supplier=TME; ComponentLink6URL: https://datasheet.octopart.com:443/93LC56B-I-SN-Microchip-datasheet-17371814.pdf?src-supplier=Microchip+SCT; ComponentLink6Description: https://datasheet.octopart.com:443/93LC56B-I-SN-Microchip-datasheet-17371814.pdf?src-supplier=Microchip+SCT; ComponentLink7URL: https://datasheet.octopart.com:443/93LC56B-I-SN-Microchip-datasheet-128589246.pdf?src-supplier=X-ON; ComponentLink7Description: https://datasheet.octopart.com:443/93LC56B-I-SN-Microchip-datasheet-128589246.pdf?src-supplier=X-ON; ComponentLink8URL: https://datasheet.octopart.com:443/93LC56B-I-SN-Microchip-datasheet-14358349.pdf?src-supplier=Farnell; ComponentLink8Description: https://datasheet.octopart.com:443/93LC56B-I-SN-Microchip-datasheet-14358349.pdf?src-supplier=Farnell; ComponentLink9URL: https://datasheet.octopart.com:443/93LC56B-I/SN.-Microchip-datasheet-656095.pdf?src-supplier=Farnell; ComponentLink9Description: https://datasheet.octopart.com:443/93LC56B-I/SN.-Microchip-datasheet-656095.pdf?src-supplier=Farnell; ComponentLink10URL: https://datasheet.octopart.com:443/93LC56B-I/SN-Microchip-datasheet-9625709.pdf?src-supplier=RS+(Formerly+Allied+Electronics); ComponentLink10Description: https://datasheet.octopart.com:443/93LC56B-I/SN-Microchip-datasheet-9625709.pdf?src-supplier=RS+(Formerly+Allied+Electronics); ComponentLink11URL: https://datasheet.octopart.com:443/93LC56B-I/SN-Microchip-datasheet-532015.pdf?src-supplier=element14; ComponentLink11Description: https://datasheet.octopart.com:443/93LC56B-I/SN-Microchip-datasheet-532015.pdf?src-supplier=element14; ComponentLink12URL: https://datasheet.octopart.com:443/93LC56B-I/SN-Microchip-datasheet-14152761.pdf?src-supplier=iiiC; ComponentLink12Description: https://datasheet.octopart.com:443/93LC56B-I/SN-Microchip-datasheet-14152761.pdf?src-supplier=iiiC; ComponentLink13URL: http://sigma.octopart.com:80/188449173/materials_sheet/Microchip-93LC56B-I-SN.pdf?src-supplier=Compliance+Statements; ComponentLink13Description: http://sigma.octopart.com:80/188449173/materials_sheet/Microchip-93LC56B-I-SN.pdf?src-supplier=Compliance+Statements; ComponentLink14URL: http://sigma.octopart.com:80/190563418/materials_sheet/Microchip-93LC56B-I-SN.pdf?src-supplier=Compliance+Statements; ComponentLink14Description: http://sigma.octopart.com:80/190563418/materials_sheet/Microchip-93LC56B-I-SN.pdf?src-supplier=Compliance+Statements; ComponentLink15URL: http://sigma.octopart.com:80/rohs_statement/Microchip-company-71.pdf?src-supplier=Compliance+Statements; ComponentLink15Description: http://sigma.octopart.com:80/rohs_statement/Microchip-company-71.pdf?src-supplier=Compliance+Statements; ComponentLink16URL: http://sigma.octopart.com:80/reach_statement/Microchip-company-70.pdf?src-supplier=Compliance+Statements; ComponentLink16Description: http://sigma.octopart.com:80/reach_statement/Microchip-company-70.pdf?src-supplier=Compliance+Statements; ComponentLink17URL: http://sigma.octopart.com:80/conflict_mineral_statement/Microchip-company-69.pdf?src-supplier=Compliance+Statements; ComponentLink17Description: http://sigma.octopart.com:80/conflict_mineral_statement/Microchip-company-69.pdf?src-supplier=Compliance+Statements; ComponentLink18URL: http://sigma.octopart.com:80/conflict_mineral_statement/Microchip-company-68.pdf?src-supplier=Compliance+Statements; ComponentLink18Description: http://sigma.octopart.com:80/conflict_mineral_statement/Microchip-company-68.pdf?src-supplier=Compliance+Statements
X?#1 = ECS-2520MV-120-BN-TR: Oscillator XO 12MHz ±50ppm 15pF HCMOS 55% 1.8V/2.5V/3.3V 4-Pin Mini-CSMD T/R; Manufacturer: ECS International; Body Material: Ceramic; Fall Time: 7ns; Max Supply Current: 6mA; Max Supply Voltage: 3.6V; Min Supply Voltage: 1.6V; Supplier: Arrow Electronics; Supplier Part Number: ECS-2520MV-120-BN-TR; Manufacturer Part Number: ECS-2520MV-120-BN-TR; RoHS: Compliant; Category: Crystals; Stock: 6000; Pricing: 3000=0,73, 6000=0,686 (USD); Frequency: 12MHz; Frequency Stability: 50ppm; Lifecycle Status: Production; Load Capacitance: 15pF; Max Operating Temperature: 85°C; Min Operating Temperature: -40°C; Mounting Technology: Surface Mount; Number of Terminals: 4; REACH SVHC: Yes; Rise Time: 7ns; Schedule B: 8542310000, 8542310000|8542310000|8542310000|8542310000|8542310000|8542310000|8542310000|8542310000|8542310000|8542310000|8542310000|8542310000|8542310000|8542310000|8542310000|8542310000|8542310000|8542310000|8542310000|8542310000|8542310000|8542310000|8542310000|85, 8542390000; ComponentLink1URL: https://datasheet.octopart.com:443/ECS-2520MV-120-BN-TR-ECS-International-datasheet-179230857.pdf?src-supplier=IHS; ComponentLink1Description: https://datasheet.octopart.com:443/ECS-2520MV-120-BN-TR-ECS-International-datasheet-179230857.pdf?src-supplier=IHS; ComponentLink2URL: https://datasheet.octopart.com:443/ECS-2520MV-120-BN-TR-ECS-International-datasheet-104167383.pdf?src-supplier=Master+Electronics; ComponentLink2Description: https://datasheet.octopart.com:443/ECS-2520MV-120-BN-TR-ECS-International-datasheet-104167383.pdf?src-supplier=Master+Electronics; ComponentLink3URL: https://datasheet.octopart.com:443/ECS-2520MV-120-BN-TR-ECS-International-datasheet-189099886.pdf?src-supplier=Master+Electronics; ComponentLink3Description: https://datasheet.octopart.com:443/ECS-2520MV-120-BN-TR-ECS-International-datasheet-189099886.pdf?src-supplier=Master+Electronics

## Sheet Zynq_PS_System.SchDoc: Zynq PS System
size A3; DrawnBy: Emre Can Damyanlı; Revision: A.1; SheetNumber: 5; SheetTotal: 7; ENG_APP_DATE: --/--/--; DSN_APP_DATE: --/--/--; CHK_APP_DATE: --/--/--
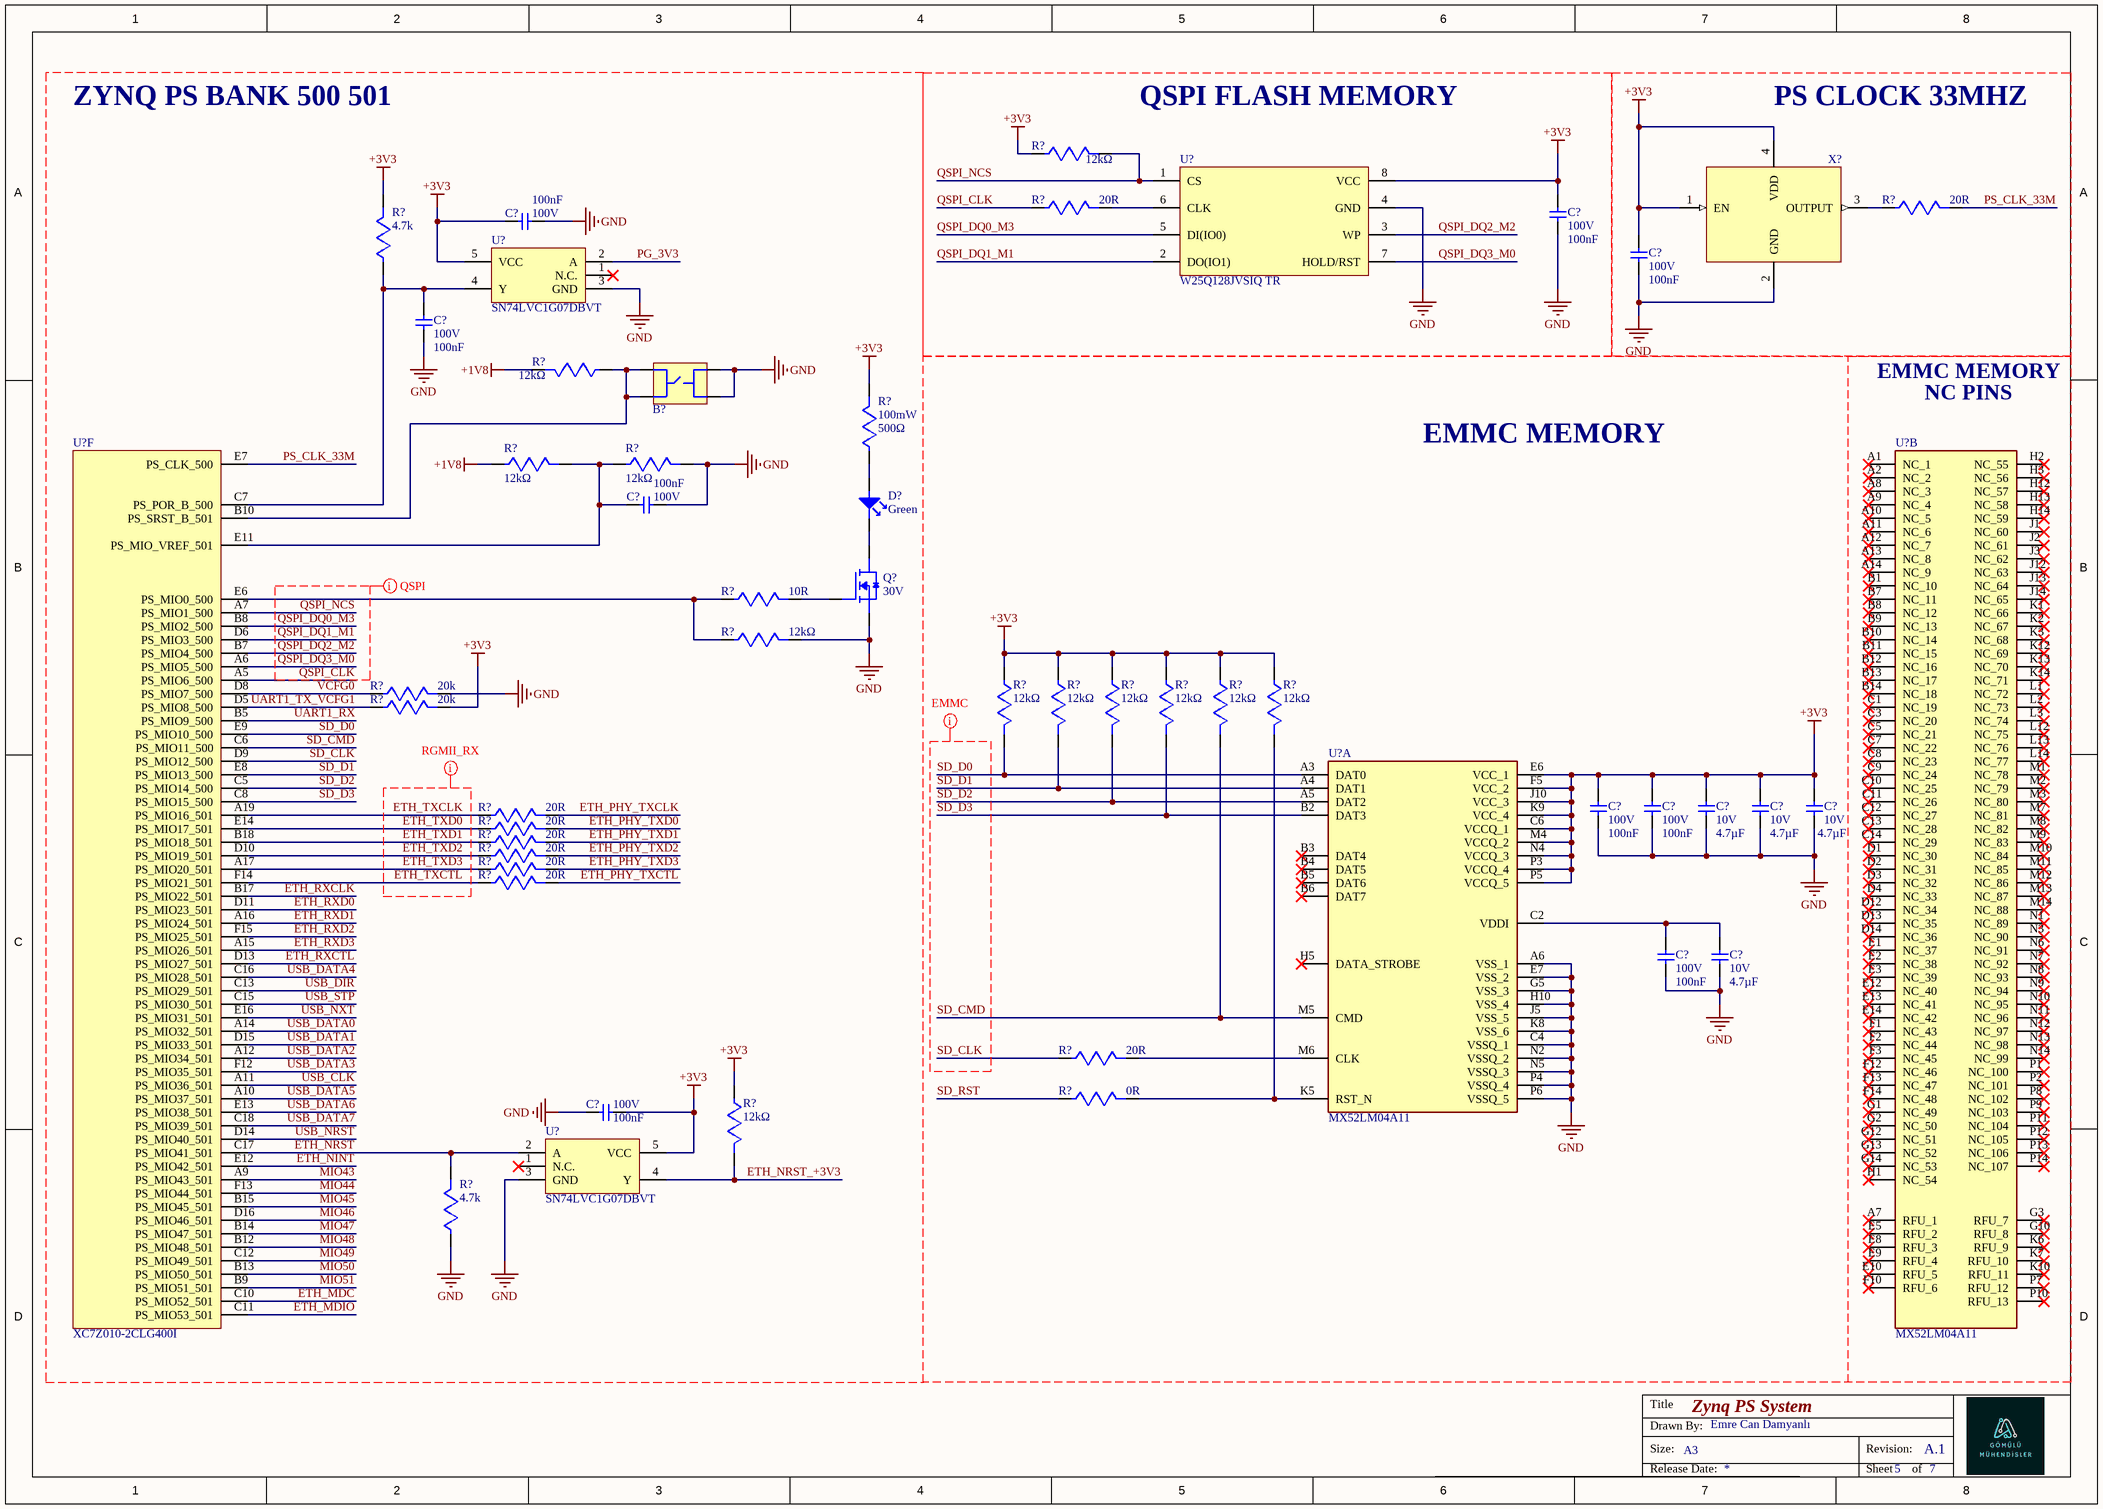
[diagram p4: Zynq_PS_System.SchDoc]

### Parts
(Parts that share a designator on the sheet are numbered #1, #2 ... from top to bottom, then left to right.)
B?#2  GSPTS0020  [SW4_PTS815 SJM 250 SMTR LFS_CNK]  (value not drawn)
C?#116  value 100nF  Voltage Rating: 100V  [CAPC1608X94N]  (hidden comment: GCJ188R72A104KA01D)
C?#117  value 100nF  Voltage Rating: 100V  [CAPC1608X94N]  (hidden comment: GCJ188R72A104KA01D)
C?#118  value 100nF  Voltage Rating: 100V  [CAPC1608X94N]  (hidden comment: GCJ188R72A104KA01D)
C?#119  value 100nF  Voltage Rating: 100V  [CAPC1608X94N]  (hidden comment: GCJ188R72A104KA01D)
C?#120  value 100nF  Voltage Rating: 100V  [CAPC1608X94N]  (hidden comment: GCJ188R72A104KA01D)
C?#121  value 100nF  Voltage Rating: 100V  [CAPC1608X94N]  (hidden comment: GCJ188R72A104KA01D)
C?#122  value 100nF  Voltage Rating: 100V  [CAPC1608X94N]  (hidden comment: GCJ188R72A104KA01D)
C?#123  value 4.7µF  Voltage Rating: 10V  [CAPC1005X55N]  (hidden comment: CL05A475MP5NRNC)
C?#124  value 4.7µF  Voltage Rating: 10V  [CAPC1005X55N]  (hidden comment: CL05A475MP5NRNC)
C?#125  value 4.7µF  Voltage Rating: 10V  [CAPC1005X55N]  (hidden comment: CL05A475MP5NRNC)
C?#126  value 100nF  Voltage Rating: 100V  [CAPC1608X94N]  (hidden comment: GCJ188R72A104KA01D)
C?#127  value 4.7µF  Voltage Rating: 10V  [CAPC1005X55N]  (hidden comment: CL05A475MP5NRNC)
C?#128  value 100nF  Voltage Rating: 100V  [CAPC1608X94N]  (hidden comment: GCJ188R72A104KA01D)
D?#7  Color: Green  [LED_0603_GREEN]  (hidden comment: LTST-C191KGKT)
Q?#6  Drain to Source Voltage (Vdss): 30V  [CDSOT23]  (hidden comment: DMG3402L-7)
R?#74  value 12kΩ  [RESISTOR_0603]  (hidden comment: RC0603FR-0712KL)
R?#75  value 20R  (hidden comment: RC0603FR-0720RL)
R?#76  value 20R  (hidden comment: RC0603FR-0720RL)
R?#77  value 4.7k  [RESISTOR_0603]  (hidden comment: RC0603FR-074K7L)
R?#78  value 12kΩ  [RESISTOR_0603]  (hidden comment: RC0603FR-0712KL)
R?#79  value 500Ω  Power Rating: 100mW  [RESISTOR_0603]  (hidden comment: RT0603BRC07500RL)
R?#80  value 12kΩ  [RESISTOR_0603]  (hidden comment: RC0603FR-0712KL)
R?#81  value 12kΩ  [RESISTOR_0603]  (hidden comment: RC0603FR-0712KL)
R?#82  value 10R  [RESISTOR_0603]  (hidden comment: RC0603FR-0710RL)
R?#83  value 12kΩ  [RESISTOR_0603]  (hidden comment: RC0603FR-0712KL)
R?#84  value 20k  [RESISTOR_0603]  (hidden comment: RC0603FR-0720KL)
R?#85  value 12kΩ  [RESISTOR_0603]  (hidden comment: RC0603FR-0712KL)
R?#86  value 12kΩ  [RESISTOR_0603]  (hidden comment: RC0603FR-0712KL)
R?#87  value 12kΩ  [RESISTOR_0603]  (hidden comment: RC0603FR-0712KL)
R?#88  value 12kΩ  [RESISTOR_0603]  (hidden comment: RC0603FR-0712KL)
R?#89  value 12kΩ  [RESISTOR_0603]  (hidden comment: RC0603FR-0712KL)
R?#90  value 12kΩ  [RESISTOR_0603]  (hidden comment: RC0603FR-0712KL)
R?#91  value 20k  [RESISTOR_0603]  (hidden comment: RC0603FR-0720KL)
R?#92  value 20R  (hidden comment: RC0603FR-0720RL)
R?#93  value 20R  (hidden comment: RC0603FR-0720RL)
R?#94  value 20R  (hidden comment: RC0603FR-0720RL)
R?#95  value 20R  (hidden comment: RC0603FR-0720RL)
R?#96  value 20R  (hidden comment: RC0603FR-0720RL)
R?#97  value 20R  (hidden comment: RC0603FR-0720RL)
R?#98  value 20R  (hidden comment: RC0603FR-0720RL)
R?#99  value 0R  [RESISTOR_0603]  (hidden comment: RC0603FR-070RL)
R?#100  value 12kΩ  [RESISTOR_0603]  (hidden comment: RC0603FR-0712KL)
R?#101  value 4.7k  [RESISTOR_0603]  (hidden comment: RC0603FR-074K7L)
U?#14  W25Q128JVSIQ TR  [SOIC127P790X216-8N]
U?#15  SN74LVC1G07DBVT  [SOT95P280X145-5N]
U?#16  XC7Z010-2CLG400I  [BGA400C80P20X20_1700X1700X160]  (part F of 9)
U?#17  MX52LM04A11  [BGA153C50P14X14_1150X1300X80]  (part B of 2)
U?#18  MX52LM04A11  [BGA153C50P14X14_1150X1300X80]  (part A of 2)
U?#19  SN74LVC1G07DBVT  [SOT95P280X145-5N]
X?#2  ECS-2520MV-333.3-BN-TR  [OSCCC250X200X90N]  (value not drawn)